# EAGLE schematic SR_Board (EAGLE 7.6.0)
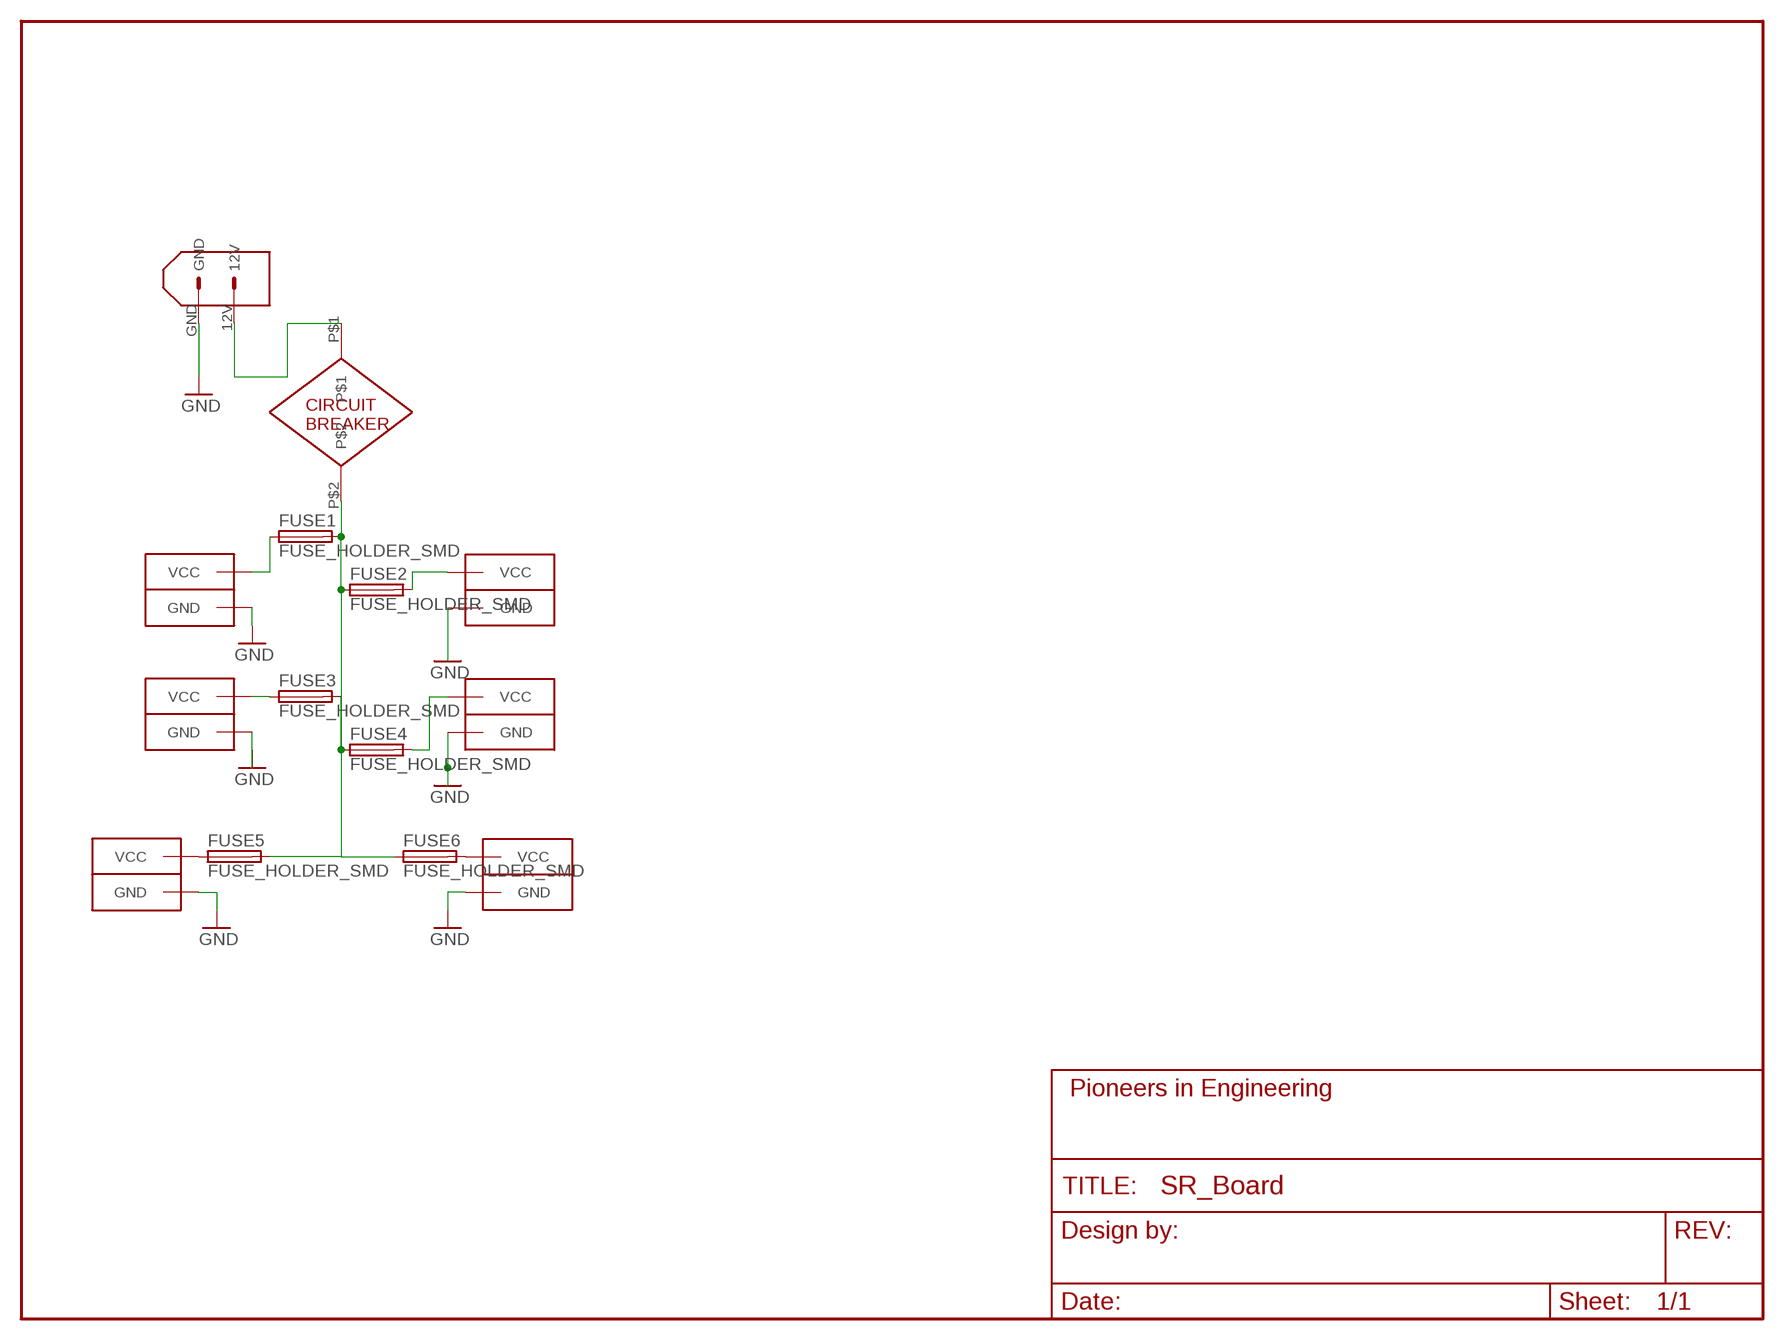
[diagram p0: schematic, sheet 1]

## Parts
CIRCUIT_BREAKER  CIRC_BREAKER  [CIRC_BREAKER]
CONN1  ANDERSONHORIZONTAL  [ANDERSON_HORIZONTAL]
CONN2  ANDERSONHORIZONTAL  [ANDERSON_HORIZONTAL]
CONN3  ANDERSONHORIZONTAL  [ANDERSON_HORIZONTAL]
CONN4  ANDERSONHORIZONTAL  [ANDERSON_HORIZONTAL]
CONN5  ANDERSONHORIZONTAL  [ANDERSON_HORIZONTAL]
CONN6  ANDERSONHORIZONTAL  [ANDERSON_HORIZONTAL]
FUSE1  FUSE_HOLDER_SMD  [FUSE_HOLDER_SMD]
FUSE2  FUSE_HOLDER_SMD  [FUSE_HOLDER_SMD]
FUSE3  FUSE_HOLDER_SMD  [FUSE_HOLDER_SMD]
FUSE4  FUSE_HOLDER_SMD  [FUSE_HOLDER_SMD]
FUSE5  FUSE_HOLDER_SMD  [FUSE_HOLDER_SMD]
FUSE6  FUSE_HOLDER_SMD  [FUSE_HOLDER_SMD]
U$1  XT60CONNECTOR  [XT60CONNECTOR]

## Nets
12V: CIRCUIT_BREAKER.P$2 FUSE1.P$2_DOWN FUSE1.P$2_UP FUSE2.P$1_DOWN FUSE2.P$1_UP FUSE3.P$2_DOWN FUSE3.P$2_UP FUSE4.P$1_DOWN FUSE4.P$1_UP FUSE5.P$2_DOWN FUSE5.P$2_UP FUSE6.P$1_DOWN FUSE6.P$1_UP
BAT: CIRCUIT_BREAKER.P$1 U$1.12V
GND: CONN2.PIN1(GND) CONN2.PIN1-LEAD(GND) CONN3.PIN1(GND) CONN3.PIN1-LEAD(GND) CONN5.PIN1(GND) CONN5.PIN1-LEAD(GND) CONN6.PIN1(GND) CONN6.PIN1-LEAD(GND) U$1.GND
N$1: CONN2.PIN2(VCC) CONN2.PIN2-LEAD(VCC) FUSE1.P$1_DOWN FUSE1.P$1_UP
N$2: CONN5.PIN2(VCC) CONN5.PIN2-LEAD(VCC) FUSE4.P$2_DOWN FUSE4.P$2_UP
N$3: CONN1.PIN2(VCC) CONN1.PIN2-LEAD(VCC) FUSE3.P$1_DOWN FUSE3.P$1_UP
N$4: CONN3.PIN2(VCC) CONN3.PIN2-LEAD(VCC) FUSE5.P$1_DOWN FUSE5.P$1_UP
N$5: CONN4.PIN2(VCC) CONN4.PIN2-LEAD(VCC) FUSE2.P$2_DOWN FUSE2.P$2_UP
N$6: CONN4.PIN1(GND) CONN4.PIN1-LEAD(GND)
N$7: CONN6.PIN2(VCC) CONN6.PIN2-LEAD(VCC) FUSE6.P$2_DOWN FUSE6.P$2_UP
N$8: CONN1.PIN1(GND) CONN1.PIN1-LEAD(GND)

## Library data of the parts
CIRCUIT_BREAKER = pie:CIRC_BREAKER: PiE Circuit Breaker: product page <http://www.waytekwire.com/item/46977/Bussmann-25550-B-2-Mid-Range-Circuit-Breaker-/>; MANUF: WAYTEK; MANUF-PN: 46977
CONN1-CONN6 = pie:ANDERSON: 2-pin 25A Anderson Connector http://www.alliedelec.com/images/products/datasheets/bm/ANDERSON_POWER_PRODUCTS/70162018.pdf; PIE-INT-REF-NUM: Anderson
FUSE1-FUSE6 = pie:FUSE_HOLDER_SMD: ATC/ATO Fuse Holder. Original variant datasheet <http://keyelco.com/userAssets/file/M65p43.pdf> and Digikey <http://www.digikey.com/product-detail/en/keystone-electronics/3587/36-3587-ND/2137315>; DIGIKEY-PN: 36-3587-ND; MANUF: KEYSTONE; MANUF-PN: 3587
U$1 = pie:XT60CONNECTOR: 12V XT60 power connector; PARTNUMBER: PRT-10474